# Altium project nescue_pcb.PrjPcb
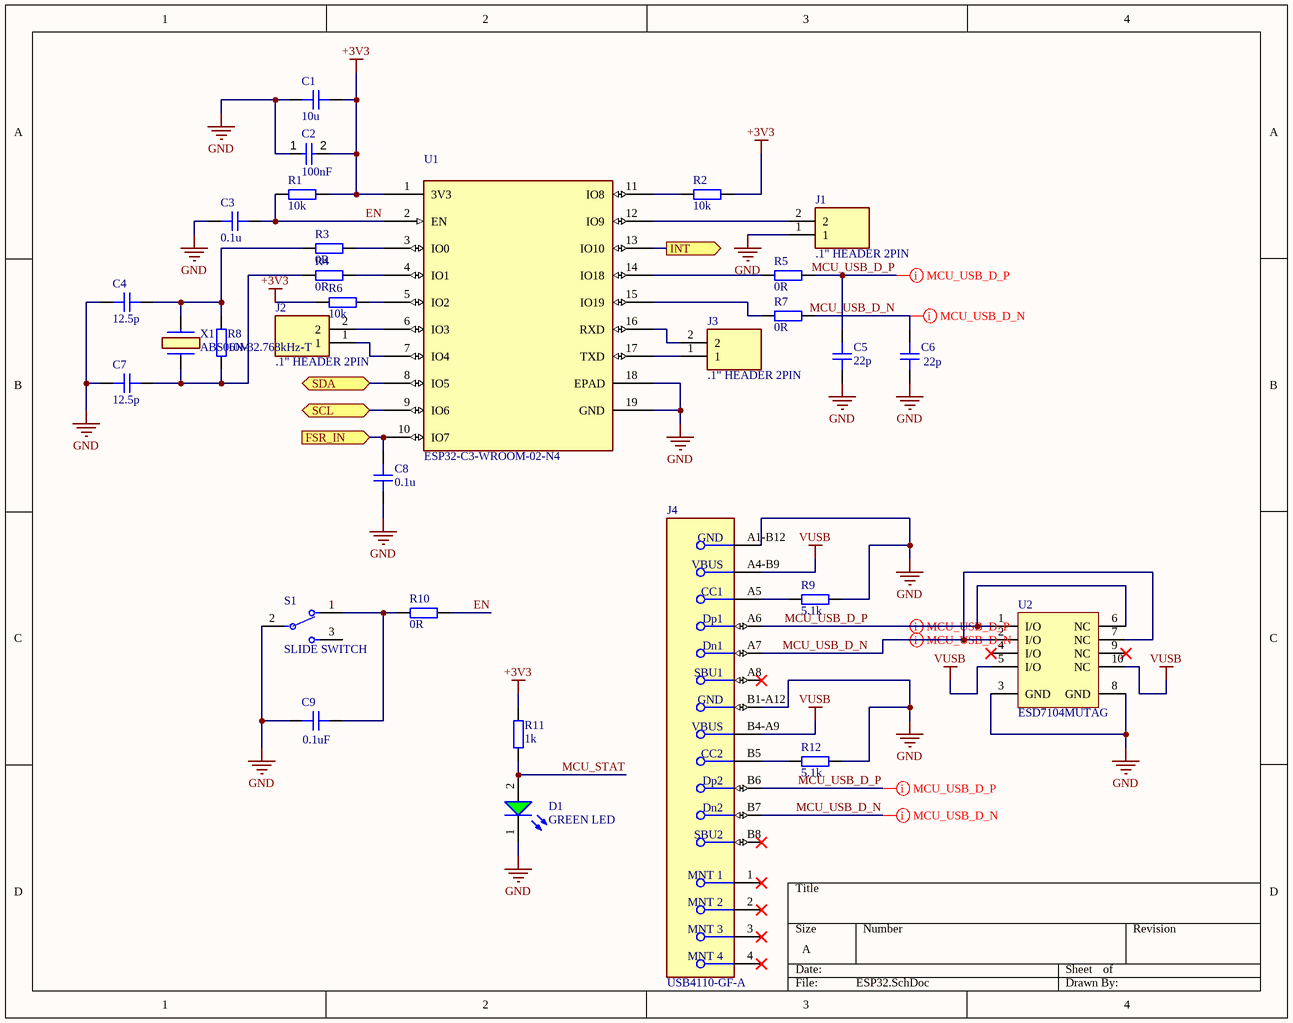
[diagram p0: ESP32.SchDoc]
3 sheets, 64 parts. Net scope: flat (ports and power ports of the same name join across sheets).
Sheets:
  ESP32.SchDoc
  Battery.SchDoc
  Sensors.SchDoc

## Sheet ESP32.SchDoc
size A; SheetNumber: 1; SheetTotal: 3

### Parts
C1  10u  [CAP_0603]
C2  value 100nF  [CAP_0603]  (hidden comment: CAP .1uF)
C3  0.1u  [CAP_0603]
C4  12.5p  [CAP_0603]
C5  22p  [CAP_0603]
C6  22p  [CAP_0603]
C7  12.5p  [CAP_0603]
C8  0.1u  [CAP_0603]
C9  0.1uF  [CAP_0603]
D1  GREEN LED  [WL-SMCW_0603_150060xx75000]
J1  .1" HEADER 2PIN  [HDRV2W64P0X254_1X2_508X250X850P]  (no BOM)
J2  .1" HEADER 2PIN  [HDRV2W64P0X254_1X2_508X250X850P]  (no BOM)
J3  .1" HEADER 2PIN  [HDRV2W64P0X254_1X2_508X250X850P]  (no BOM)
J4  USB4110-GF-A  [FP-USB4110-GF-A-MFG]
R1  10k  [RES_0603]
R2  10k  [RES_0603]
R3  0R  [RES_0603]
R4  0R  [RES_0603]
R5  0R  [RES_0603]
R6  10k  [RES_0603]
R7  0R  [RES_0603]
R8  10M  [RES_0603]
R9  5.1k  [RES_0603]
R10  0R  [RES_0603]
R11  1k  [RES_0603]
R12  5.1k  [RES_0603]
S1  SLIDE SWITCH  [SLW8839352AD]
U1  ESP32-C3-WROOM-02-N4  [MODULE_ESP32-C3-WROOM-02-H4]
U2  ESD7104MUTAG  [ONSC-UDFN-10-517BB-01_V]
X1  ABS06N-32.768kHz-T  [ABS06N32768kHzT]

### Ports
FSR_IN (in, see Sensors[1C]), INT (out, see Sensors[1B]), SCL (bidir, see Sensors[1B]), SDA (bidir, see Sensors[1B])

### Nets
+3V3: C1.2 C2.2 R1.2 R2.2 R6.1 R11.1 U1.1(3V3)
GND: C1.1 C2.1 C3.1 C4.1 C5.1 C6.1 C7.1 C8.1 C9.1 D1.1(K) J1.1 J4.A1-B12(GND) J4.B1-A12(GND) R9.2 R12.2 S1.2(C) U1.18(EPAD) U1.19(GND) U2.3(GND) U2.8(GND)
VUSB: J4.A4-B9(VBUS) J4.B4-A9(VBUS) U2.5(I/O) U2.10(NC)
EN: C3.2 R1.1 R10.2 U1.2(EN)
MCU_STAT: D1.2(A) R11.2
MCU_USB_D_N: C6.2 J4.A7(Dn1) J4.B7(Dn2) R7.2 U2.2(I/O) U2.7(NC)
MCU_USB_D_P: C5.2 J4.A6(Dp1) J4.B6(Dp2) R5.2 U2.1(I/O) U2.6(NC)
NetC4_2: C4.2 R3.1 R8.2 X1.2
NetC7_2: C7.2 R4.1 R8.1 X1.1
NetC8_2: C8.2 U1.10(IO7) ; port FSR_IN
NetC9_2: C9.2 R10.1 S1.1
NetJ1_2: J1.2 U1.12(IO9)
NetJ2_1: J2.1 U1.7(IO4)
NetJ2_2: J2.2 U1.6(IO3)
NetJ3_1: J3.1 U1.17(TXD)
NetJ3_2: J3.2 U1.16(RXD)
NetJ4_A5: J4.A5(CC1) R9.1
NetJ4_B5: J4.B5(CC2) R12.1
NetR2_1: R2.1 U1.11(IO8)
NetR3_2: R3.2 U1.3(IO0)
NetR4_2: R4.2 U1.4(IO1)
NetR5_1: R5.1 U1.14(IO18)
NetR6_2: R6.2 U1.5(IO2)
NetR7_1: R7.1 U1.15(IO19)
NetU1_8: U1.8(IO5) ; port SDA
NetU1_9: U1.9(IO6) ; port SCL
NetU1_13: U1.13(IO10) ; port INT

Not connected (* = marked no-connect by the designer): J4 1(MNT_1)* 2(MNT_2)* 3(MNT_3)* 4(MNT_4)* A8(SBU1)* B8(SBU2)*; S1 3; U2 4(I/O)* 9(NC)*

### Layout directives
differential pair: MCU_USB_D_N, MCU_USB_D_P

### Library data of the parts
C1 C3-C9 = CAP_0603: Capacitor SMD 0603; Manufacturer: *; Manufacturer Part Number: *; Distributor Link: *; LCSC: *; Rating: *; Dielectric: *
C2 = CMP-001-00088-1: Capacitor .1uF 10% 16V 0603; Voltage Rating: 16V; Source: Generic_Schematic_Library.SchLib; Design Item ID: CAP .1uF; Tolerance: 10%
D1 = CMP-007-00046-2: Single Color LED, Green, Water Clear, 1.1mm; Forward Current: 30mA; Pins: 2; Mounting Technology: Surface Mount; Max Operating Temperature: 85°C; RoHS Compliant: Yes; Min Operating Temperature: -40°C
J1-J3 = CMP-002-00117-1: Connector; Source: SamacSys.SchLib; Design Item ID: .1" HEADER 2PIN
J4 = CMP-245163-000002-1: CONN USB 2.0 TYPE-C R/A SMT; Manufacturer: GCT; Conn Orientation: Right Angle; Usb Standard: USB 2.0; Voltage Rating: 20V; Current Rating: 3/4.25/1.25/0.25A; Number Of Contacts: 16; Is Female: yes; Shielding: true; Standoff Height: 0.1mm; Octopart: https://octopart.com/usb4110-gf-a-gct-103941985; Temperature: -40°C to +85°C; RoHS: TRUE; Automotive: No; Contact Material: Gold,Nickel; Device Class L1: Connectors; Device Class L2: USB Connectors; Package: 0; Lead Free: Yes; ComponentLink2URL: https://gct.co/files/drawings/usb4110.pdf; Temperature Range High: +85°C; Temperature Range Low: -40°C; Height: 3.46mm; Manufacturer Part Number: USB4110-GF-A; ComponentLink2Description: Datasheet; Device Class L3: unset; Digikey Description: CONN USB 2.0 TYPE-C R/A SMT; Category: Conn
R1-R12 = RES_0603: Resistor SMD 0603; Manufacturer: *; Manufacturer Part Number: *; Distributor Link: *; LCSC: *
S1 = CMP-011-00019-2: Switch; Manufacturer_Name: Same Sky; Manufacturer_Part_Number: SLW-883935-2A-D; Arrow Price/Stock: https://www.arrow.com/en/products/slw-883935-2a-d/cui-devices?utm_currency=USD&region=nac; Arrow Part Number: SLW-883935-2A-D; Datasheet Link: https://www.sameskydevices.com/product/resource/supplyframepdf/slw-883935-2a-d.pdf; Mouser Part Number: 179-SLW-883935-2A-D; Design Item ID: SLW-883935-2A-D; Mouser Price/Stock: https://www.mouser.co.uk/ProductDetail/Same-Sky/SLW-883935-2A-D?qs=1Kr7Jg1SGW%2Fv9j8ky6fn%2FQ%3D%3D; Source: SamacSys.SchLib; Height: 6.1mm
U1 = ESP32-C3-WROOM-02-N4: ESP32 C3-WROOM-02-N4 Module MCU; pin to pad: 3>18 4>17 5>16 6>15 7>3 8>4 9>5 10>6 11>7 12>8 13>10 14>13 15>14 16>11 17>12 18>19 19>9; Manufacturer: Espressif Systems; Manufacturer Part Number: 1965-ESP32-C3-WROOM-02-N4TR-ND
U2 = CMP-1063-00242-1: Transient Voltage Suppressor, Low Capacitance ESD Protection for High Speed Data, 10-Pin UDFN, Pb-Free, Tape and Reel; Manufacturer: On Semiconductor; IR Max (uA): 1; Number of Lines: 4; VRWM Max (V): 5; Direction: Bidirectional; V(BR) Min (V): 5.5; PackageDescription: 10-Pin Small Outline No-Lead, Body 2.5 x 1 mm, Pitch 0.5 mm; ComponentLink3URL: http://www.onsemi.com/pub_link/Collateral/517BB.PDF; PackageReference: UDFN-10-517BB-01; Mounting Technology: Surface Mount; PartNumber: ESD7104MUTAG; ComponentLink1URL: http://www.onsemi.com/; ComponentLink1Description: Manufacturer URL; DatasheetVersion: Rev. 2; ComponentLink2Description: Datasheet; ComponentLink2URL: http://www.onsemi.cn/pub_link/Collateral/ESD7104-D.PDF; PackageVersion: Rev. O, 11/2009; Packing: Tape and Reel; RoHS: Pb-Free; ComponentLink3Description: Package Specification
X1 = ABS06N-32.768kHz-T: 32.768 kHz +/-20ppm Crystal 12.5pF 50 kOhms 2-SMD, No Lead; Manufacturer_Name: ABRACON; Geometry.Height: 0.6mm; Mouser Part Number: *; Mouser Price/Stock: *; Manufacturer_Part_Number: ABS06N-32.768kHz-T; Datasheet Link: https://abracon.com/datasheets/ABS06N.pdf

## Sheet Battery.SchDoc
size A; SheetNumber: 2; SheetTotal: 3
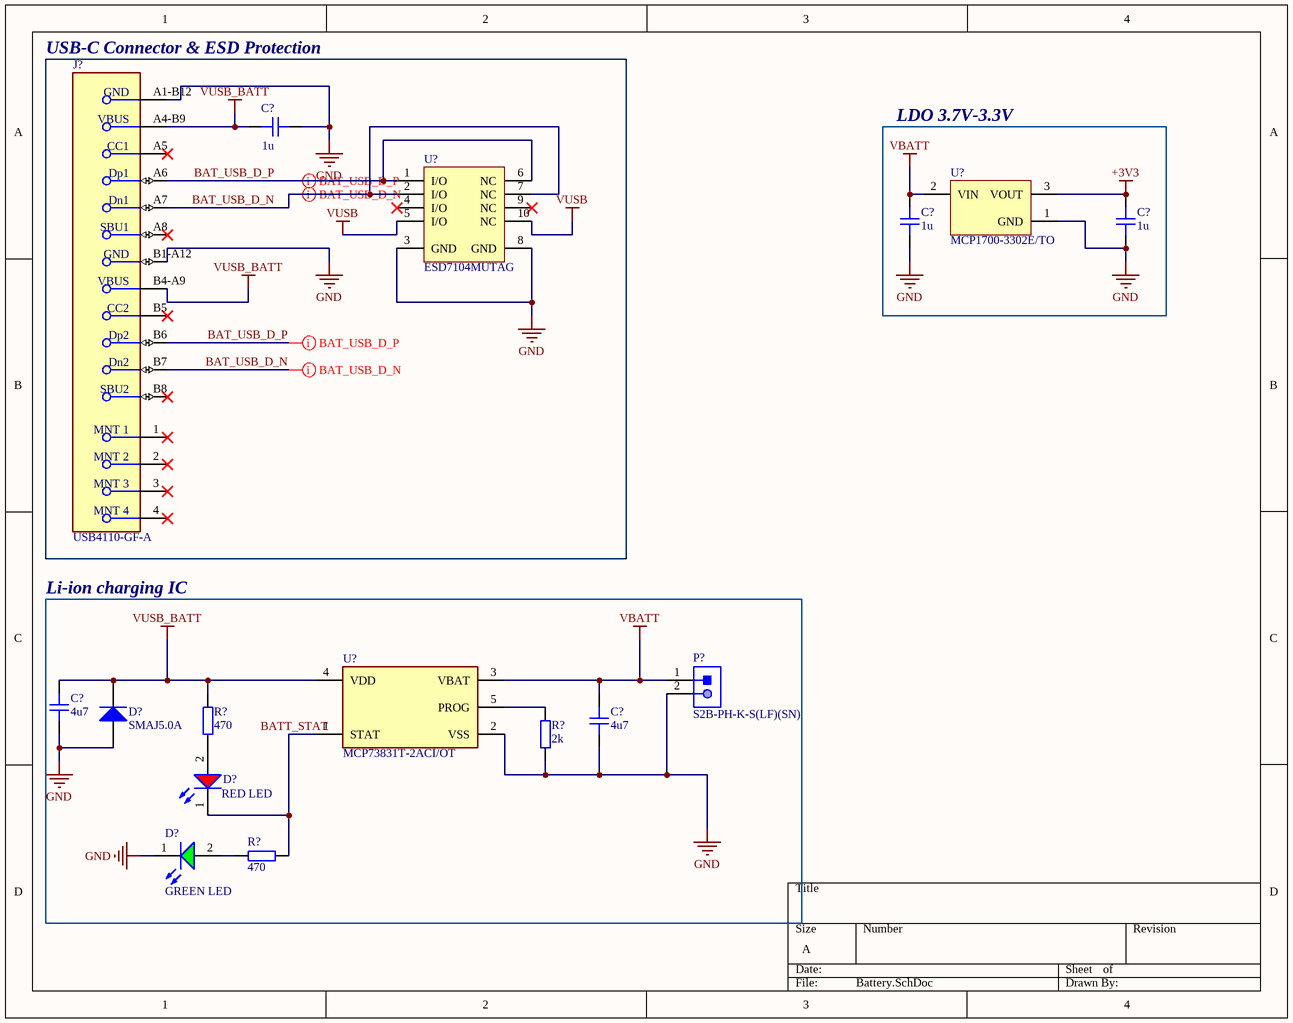
[diagram p1: Battery.SchDoc]

### Parts
(Parts that share a designator on the sheet are numbered #1, #2 ... from top to bottom, then left to right.)
C?#1  1u  [CAP_0603]
C?#2  1u  [CAP_0603]
C?#3  1u  [CAP_0603]
C?#4  4u7  [CAP_0603]
C?#5  4u7  [CAP_0603]
D?#1  SMAJ5.0A  [BOUR-SMA-2_V]
D?#2  RED LED  [WL-SMCW_0603_150060xx75000]
D?#3  GREEN LED  [WL-SMCW_0603_150060xx75000]
J?#1  USB4110-GF-A  [FP-USB4110-GF-A-MFG]
P?  S2B-PH-K-S(LF)(SN)  [JST-S2B-PH-K-S_V]
R?#1  470  [RES_0603]
R?#2  2k  [RES_0603]
R?#3  470  [RES_0603]
U?#1  ESD7104MUTAG  [ONSC-UDFN-10-517BB-01_V]
U?#2  MCP1700-3302E/TO  [TO-92-TO3]
U?#3  MCP73831T-2ACI/OT  [FP-C04-091-OT-IPC_B]

### Blocks framed on the sheet
USB-C Connector & ESD Protection: C?#1 J?#1 U?#1
LDO 3.7V-3.3V: C?#2 C?#3 U?#2
Li-ion charging IC: C?#4 C?#5 D?#1-D?#3 P? R?#1-R?#3 U?#3

### Nets
+3V3: C?#3.2 U?#2.3(VOUT)
GND: C?#1.2 C?#2.1 C?#3.1 C?#4.1 C?#5.1 D?#1.1(A) D?#3.1(K) J?#1.A1-B12(GND) J?#1.B1-A12(GND) P?.2 R?#2.1 U?#1.3(GND) U?#1.8(GND) U?#2.1(GND) U?#3.2(VSS)
VBATT: C?#2.2 C?#5.2 P?.1 U?#2.2(VIN) U?#3.3(VBAT)
VUSB: U?#1.5(I/O) U?#1.10(NC)
VUSB_BATT: C?#1.1 C?#4.2 D?#1.2(K) J?#1.A4-B9(VBUS) J?#1.B4-A9(VBUS) R?#1.2 U?#3.4(VDD)
BAT_USB_D_N: J?#1.A7(Dn1) J?#1.B7(Dn2) U?#1.2(I/O) U?#1.7(NC)
BAT_USB_D_P: J?#1.A6(Dp1) J?#1.B6(Dp2) U?#1.1(I/O) U?#1.6(NC)
NetD?#2_1: D?#2.1(K) R?#3.2 U?#3.1(STAT)
NetD?#2_2: D?#2.2(A) R?#1.1
NetD?#3_2: D?#3.2(A) R?#3.1
NetR?#2_2: R?#2.2 U?#3.5(PROG)

Not connected (* = marked no-connect by the designer): J?#1 1(MNT_1)* 2(MNT_2)* 3(MNT_3)* 4(MNT_4)* A5(CC1)* A8(SBU1)* B5(CC2)* B8(SBU2)*; U?#1 4(I/O)* 9(NC)*

### Layout directives
differential pair: BAT_USB_D_N, BAT_USB_D_P

### Notes on the sheet
- Labels drawn without touching a wire or pin: BATT_STAT

### Library data of the parts
C?#1-C?#5 = CAP_0603: Capacitor SMD 0603; Manufacturer: *; Manufacturer Part Number: *; Distributor Link: *; LCSC: *; Rating: *; Dielectric: *
D?#1 = CMP-2000-07090-1: SMAJ Transient Voltage Suppressor Diode Series, 3.5 V, -55 to 150 degC, 2-Pin SMA, RoHS, Tape and Reel; Manufacturer: Bourns; EDA / CAD Models: DownloadfromAcceleratedDesigns; Unidirectional Channels: 1; Voltage - Breakdown (Min): 6.4V; Voltage - Reverse Standoff (Typ): 5V; Voltage - Clamping (Max) @ Ipp: 9.2V; Other Names: SMAJ5.0ABDKR; Type: Zener; Catalog Drawings: SMAJSeriesFootprintSMAJ,SMBJSeries; Featured Product: SMAJ/SMBJ/SMCJ/SMLJDiscreteTVSDiodes; Power - Peak Pulse: 400W; Current - Peak Pulse (10/1000µs): 43.5A; Power Line Protection: No; Online Catalog: SMAJSeries; Supplier Device Package: SMA(DO-214AC); Operating Temperature: -55°C~150°C(TJ); Package Description: 2-Pin Surface Mount Device, Body 4.315 x 2.605 mm; Datasheet URL: https://datasheet.ciiva.com/25624/0900766b8112213b-25624680.pdf; Manufacturer URL: http://www.bourns.com/; Datasheet Version: 08/2012; Series: SMAJ; Family: TVS-Diodes; Bidirectional Channels: -; Applications: GeneralPurpose; Package Reference: SMA-2; Standard Package: 1; Package / Case: DO-214AC,SMA; Category: CircuitProtection; RoHS Information: SMAJSeriesMaterialDeclaration; Mounting Technology: SurfaceMount; Capacitance @ Frequency: -; Packaging: Digi-Reel®; Mounting Type: SurfaceMount
D?#2 = CMP-007-00045-2: Single Color LED, Red, Water Clear, 1.1mm; Forward Current: 30mA; Min Operating Temperature: -40°C; Max Operating Temperature: 85°C; Mounting Technology: Surface Mount; Pins: 2; RoHS Compliant: Yes
D?#3 = CMP-007-00046-2: as D1 on sheet ESP32; Pins: 2; Mounting Technology: Surface Mount; Max Operating Temperature: 85°C; RoHS Compliant: Yes; Min Operating Temperature: -40°C
J?#1 = CMP-245163-000002-1: as J4 on sheet ESP32; Octopart: https://octopart.com/usb4110-gf-a-gct-103941985; Temperature: -40°C to +85°C; RoHS: TRUE; Automotive: No; Contact Material: Gold,Nickel; Device Class L1: Connectors; Device Class L2: USB Connectors; Package: 0; Lead Free: Yes; ComponentLink2URL: https://gct.co/files/drawings/usb4110.pdf; Temperature Range High: +85°C; Temperature Range Low: -40°C; Height: 3.46mm; Manufacturer Part Number: USB4110-GF-A; ComponentLink2Description: Datasheet; Device Class L3: unset; Digikey Description: CONN USB 2.0 TYPE-C R/A SMT; Category: Conn
P? = CMP-1755-00004-1: Male Header, Pitch 2 mm, 1 x 2 Position, Height 4.8 mm, Tail Length 3.4 mm, -25 to 85 degC, RoHS, Bulk; Case\Package: Radial; Tolerance: 20%; Capacitance: 10 uF; Voltage Rating (DC): 50 V; Packaging: Bulk; ComponentLink1URL: http://www.jst-mfg.com/product/pdf/eng/ePH.pdf; Radiation Hardening: No; Height: 11 mm; Package Quantity: 200; PackageDescription: Male Header, Pitch 2 mm, 1 x 2 Position, Height 4.8 mm, Tail Length 3.4 mm; PackageReference: S2B-PH-K-S; Diameter: 5 mm; Pins: 2; Mount: Through Hole; Max Operating Temperature: 85 degC; Min Operating Temperature: -40 degC; ComponentLink1Description: Datasheet; DatasheetVersion: Dec-12; Length: 11 mm; Lead Pitch: 2 mm; REACH SVHC: No SVHC; Voltage Rating: 50 V; RoHSCompliant: true
R?#1-R?#3 = RES_0603: Resistor SMD 0603; Manufacturer: *; Manufacturer Part Number: *; Distributor Link: *; LCSC: *
U?#1 = CMP-1063-00242-1: as U2 on sheet ESP32; PackageDescription: 10-Pin Small Outline No-Lead, Body 2.5 x 1 mm, Pitch 0.5 mm; ComponentLink3URL: http://www.onsemi.com/pub_link/Collateral/517BB.PDF; PackageReference: UDFN-10-517BB-01; Mounting Technology: Surface Mount; PartNumber: ESD7104MUTAG; ComponentLink1URL: http://www.onsemi.com/; ComponentLink1Description: Manufacturer URL; DatasheetVersion: Rev. 2; ComponentLink2Description: Datasheet; ComponentLink2URL: http://www.onsemi.cn/pub_link/Collateral/ESD7104-D.PDF; PackageVersion: Rev. O, 11/2009; Packing: Tape and Reel; RoHS: Pb-Free; ComponentLink3Description: Package Specification
U?#2 = CMP-0136-00007-1: Low Quiescent Current LDO, 3-Pin TO-92, Extended TemperatureBAG; PackageReference: TO-92-TO3; PackageDescription: 3-Lead Plastic Transistor Outline (TO) [TO-92]; DatasheetVersion: revB, Feb-2007; PackageVersion: revBB, Aug-2009
U?#3 = CMP-0133-00143-2: IC CONTROLLR LI-ION 4.2V SOT23-5; Max Power Dissipation: 1.54W; Output Current: 500mA; Max Output Voltage: 4.5V; Number of Outputs: 1; Min Output Voltage: 4.168V; Min Supply Voltage: 3.75V; Max Input Voltage: 6V; Voltage Rating: 4.534V; Drain to Source Resistance: 350mR; Max Operating Temperature: 85°C; Length: 0.122inch; Number of Pins: 5; REACH SVHC: No SVHC; Radiation Hardening: No; Min Operating Temperature: -40°C; Weight: 0.00709oz; Contact Plating: Tin; Termination: SMD/SMT; Case/Package: SOT-23; Mount: Surface Mount; Width: 0.071inch; Packaging: Tape and Reel; Number of Cells: 1; Max Charge Current: 500mA; Height: 0.051inch; Number of Channels: 1; Output Voltage: 4.2V; Max Supply Voltage: 6V; Lead Free: Lead Free

## Sheet Sensors.SchDoc
size A; SheetNumber: 3; SheetTotal: 3
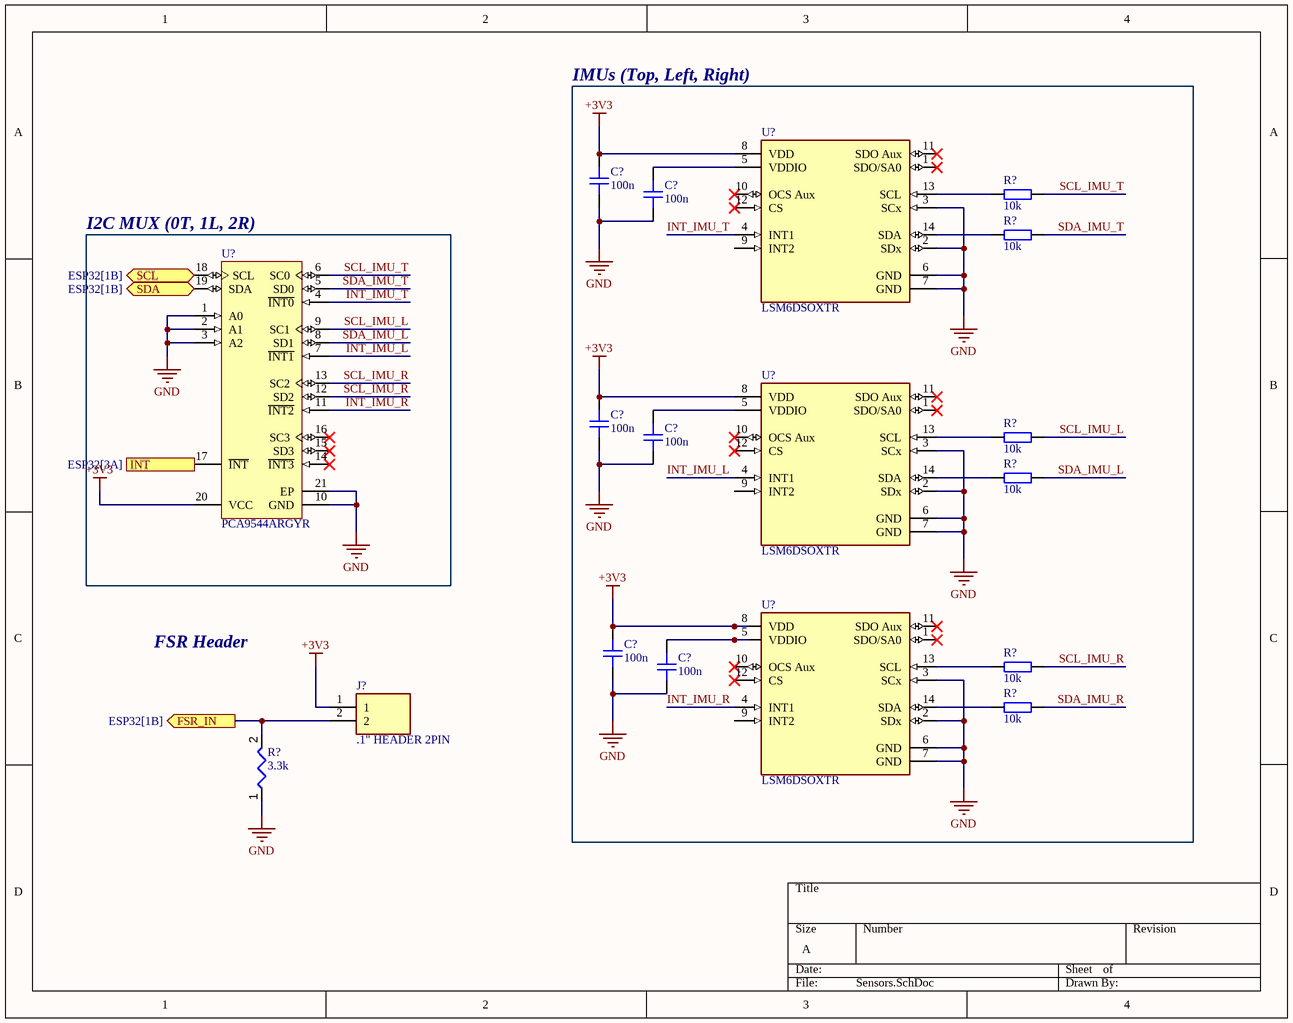
[diagram p2: Sensors.SchDoc]

### Parts
(Parts that share a designator on the sheet are numbered #1, #2 ... from top to bottom, then left to right.)
C?#6  100n  [CAP_0603]
C?#7  100n  [CAP_0603]
C?#8  100n  [CAP_0603]
C?#9  100n  [CAP_0603]
C?#10  100n  [CAP_0603]
C?#11  100n  [CAP_0603]
J?#2  .1" HEADER 2PIN  [HDRV2W64P0X254_1X2_508X250X850P]  (no BOM)
R?#4  10k  [RES_0603]
R?#5  10k  [RES_0603]
R?#6  10k  [RES_0603]
R?#7  10k  [RES_0603]
R?#8  10k  [RES_0603]
R?#9  10k  [RES_0603]
R?#10  value 3.3k  [RES_0603]  (hidden comment: RES 3.3k)
U?#4  LSM6DSOXTR  [FP-LGA-14L-DM00249496-MFG]
U?#5  PCA9544ARGYR  [RGY0020A_V]
U?#6  LSM6DSOXTR  [FP-LGA-14L-DM00249496-MFG]
U?#7  LSM6DSOXTR  [FP-LGA-14L-DM00249496-MFG]

### Blocks framed on the sheet
IMUs (Top, Left, Right): C?#6-C?#11 R?#4-R?#9 U?#4 U?#6 U?#7
I2C MUX (0T, 1L, 2R): U?#5

### Ports
FSR_IN (out, see ESP32[1B]), INT (out, see ESP32[3A]), SCL (bidir, see ESP32[1B]), SDA (bidir, see ESP32[1B])

### Nets
+3V3: C?#6.2 C?#8.2 C?#10.2 J?#2.1 U?#4.8(VDD) U?#5.20(VCC) U?#6.8(VDD) U?#7.8(VDD)
GND: C?#6.1 C?#7.1 C?#8.1 C?#9.1 C?#10.1 C?#11.1 R?#10.1 U?#4.2(SDx) U?#4.3(SCx) U?#4.6(GND) U?#4.7(GND) U?#5.1(A0) U?#5.2(A1) U?#5.3(A2) U?#5.10(GND) U?#5.21(EP) U?#6.2(SDx) U?#6.3(SCx) U?#6.6(GND) U?#6.7(GND) U?#7.2(SDx) U?#7.3(SCx) U?#7.6(GND) U?#7.7(GND)
INT_IMU_L: U?#5.7(~{INT1}) U?#6.4(INT1)
INT_IMU_R: U?#5.11(~{INT2}) U?#7.4(INT1)
INT_IMU_T: U?#4.4(INT1) U?#5.4(~{INT0})
SCL_IMU_L: R?#6.2 U?#5.9(SC1)
SCL_IMU_R: R?#8.2 U?#5.12(SD2) U?#5.13(SC2)
SCL_IMU_T: R?#4.2 U?#5.6(SC0)
SDA_IMU_L: R?#7.2 U?#5.8(SD1)
SDA_IMU_R: R?#9.2
SDA_IMU_T: R?#5.2 U?#5.5(SD0)
NetC8_2: J?#2.2 R?#10.2 ; port FSR_IN
NetC?#7_2: C?#7.2 U?#4.5(VDDIO)
NetC?#9_2: C?#9.2 U?#6.5(VDDIO)
NetC?#11_2: C?#11.2 U?#7.5(VDDIO)
NetR?#4_1: R?#4.1 U?#4.13(SCL)
NetR?#5_1: R?#5.1 U?#4.14(SDA)
NetR?#6_1: R?#6.1 U?#6.13(SCL)
NetR?#7_1: R?#7.1 U?#6.14(SDA)
NetR?#8_1: R?#8.1 U?#7.13(SCL)
NetR?#9_1: R?#9.1 U?#7.14(SDA)
NetU1_8: U?#5.19(SDA) ; port SDA
NetU1_9: U?#5.18(SCL) ; port SCL
NetU1_13: U?#5.17(~{INT}) ; port INT

Not connected (* = marked no-connect by the designer): U?#4 1(SDO/SA0)* 9(INT2) 10(OCS_Aux)* 11(SDO_Aux)* 12(CS)*; U?#5 14(~{INT3})* 15(SD3)* 16(SC3)*; U?#6 1(SDO/SA0)* 9(INT2) 10(OCS_Aux)* 11(SDO_Aux)* 12(CS)*; U?#7 1(SDO/SA0)* 9(INT2) 10(OCS_Aux)* 11(SDO_Aux)* 12(CS)*

### Notes on the sheet
- FSR Header

### Library data of the parts
C?#6-C?#11 = CAP_0603: Capacitor SMD 0603; Manufacturer: *; Manufacturer Part Number: *; Distributor Link: *; LCSC: *; Rating: *; Dielectric: *
J?#2 = CMP-002-00117-1: Connector; Source: SamacSys.SchLib; Design Item ID: .1" HEADER 2PIN
R?#4-R?#9 = RES_0603: Resistor SMD 0603; Manufacturer: *; Manufacturer Part Number: *; Distributor Link: *; LCSC: *
R?#10 = CMP-009-01777-1: Resistor 3.3k 5% 100 mW 0603; Power: 100mW; Design Item ID: RES 3.3k; Source: Generic_Schematic_Library.SchLib; Tolerance: 5%
U?#4 U?#6 U?#7 = CMP-12177-000010-1: INEMO INERTIAL MODULE: 3D ACCELE; Manufacturer: STMicroelectronics; Sensor Type: Temperature,Accelerometer,Gyroscope; Accel Range: 2/4/8/16g; Accel Sensitivity: 0.061/0.122/0.244/0.488mV/g; Operating Supply Current: 0.55mA; Gyro Range: 125/250/500/1000/2000°/s; Gyro Sensitivity: 4.375/8.75/17.5/35/70LSB/°/s; Sensor Output: I2C,SPI,Other; Min Supply Voltage: 1.62V; Max Supply Voltage: 3.6V; Octopart: https://octopart.com/lsm6dsoxtr-stmicroelectronics-98102600; Package: LGA-14L-DM00249496; Footprint Url: https://www.st.com/content/ccc/resource/technical/document/technical_note/73/17/9c/16/dd/96/4a/01/CD00134799.pdf/files/CD00134799.pdf/jcr:content/translations/en.CD00134799.pdf; ComponentLink2Description: Datasheet; Mouser Description: LSM6DSOX: 3.6 V 3 Axis Accelerometer Gyroscope iNEMO Inertial Module - LGA-14L; ComponentLink2URL: https://www.st.com/resource/en/datasheet/lsm6dsox.pdf; Temperature Range Low: -40°C; Digikey Description: INEMO INERTIAL MODULE: 3D ACCELE; Lead Free: Yes; Device Class L3: Inertial Measurement Units (IMUs); Category: IC; Device Class L2: Motion Sensors; RoHS: TRUE; Temperature: -40°C to +85°C; Height: 0.86mm; Device Class L1: Sensors; Temperature Range High: +85°C; Manufacturer Part Number: LSM6DSOXTR; Automotive: No
U?#5 = CMP-0314-00024-2: 4-Channel I2C and SMBus Multiplexer with Interrupt Logic, 2.3 to 5.5 V, -40 to 85 degC, 20-pin VQFN (RGY), Green (RoHS & no Sb/Br); Manufacturer: Texas Instruments; I2C Address: 1110 xxx; Interrupt Output: Yes; tpd max(ns): 0.3, 1; SubFamily: I2C Multiplexer, Switch; Max Frequency(kHz): 400; VCC(Min)(V): 2.3; Simultaneously Active Channels: 1; Channel Width: 4; VCC(Max)(V): 5.5; fSCLK(Max)(MHz): 0.1, 0.4; ComponentLink2Description: Package Specification; PackageDescription: 20-Leads Plastic Quad Flatpack No-Lead, 3.5 x 4.5 x 0.9 mm Body, 0.5 mm Pitch; Vcc range(V): 2.3 to 5.5; ComponentLink2URL: http://www.ti.com/litv/pdf/mpds006c; DatasheetVersion: SCPS146D; Mounting Technology: Surface Mount; Eco-Plan: Green (RoHS & no Sb/Br); ComponentLink1URL: http://www.ti.com/general/docs/lit/getliterature.tsp?genericPartNumber=PCA9544A&fileType=pdf; PackageReference: RGY0020A; 5V Tolerant I/O: Yes; Code_JEDEC: MO-241-BA; PartNumber: PCA9544ARGYR; Open Drain I/O Type: Yes; ComponentLink1Description: Datasheet; PackageVersion: revI, Jun-2011

## Nets that join several sheets
+3V3: ESP32 (7 pins), Battery (C?#3.2 U?#2.3), Sensors (8 pins)
GND: ESP32 (20 pins), Battery (15 pins), Sensors (24 pins)
VUSB: ESP32 (J4.A4-B9 J4.B4-A9 U2.5 U2.10), Battery (U?#1.5 U?#1.10)
NetC8_2: ESP32 (C8.2 U1.10), Sensors (J?#2.2 R?#10.2)
NetU1_8: ESP32 (U1.8), Sensors (U?#5.19)
NetU1_9: ESP32 (U1.9), Sensors (U?#5.18)
NetU1_13: ESP32 (U1.13), Sensors (U?#5.17)